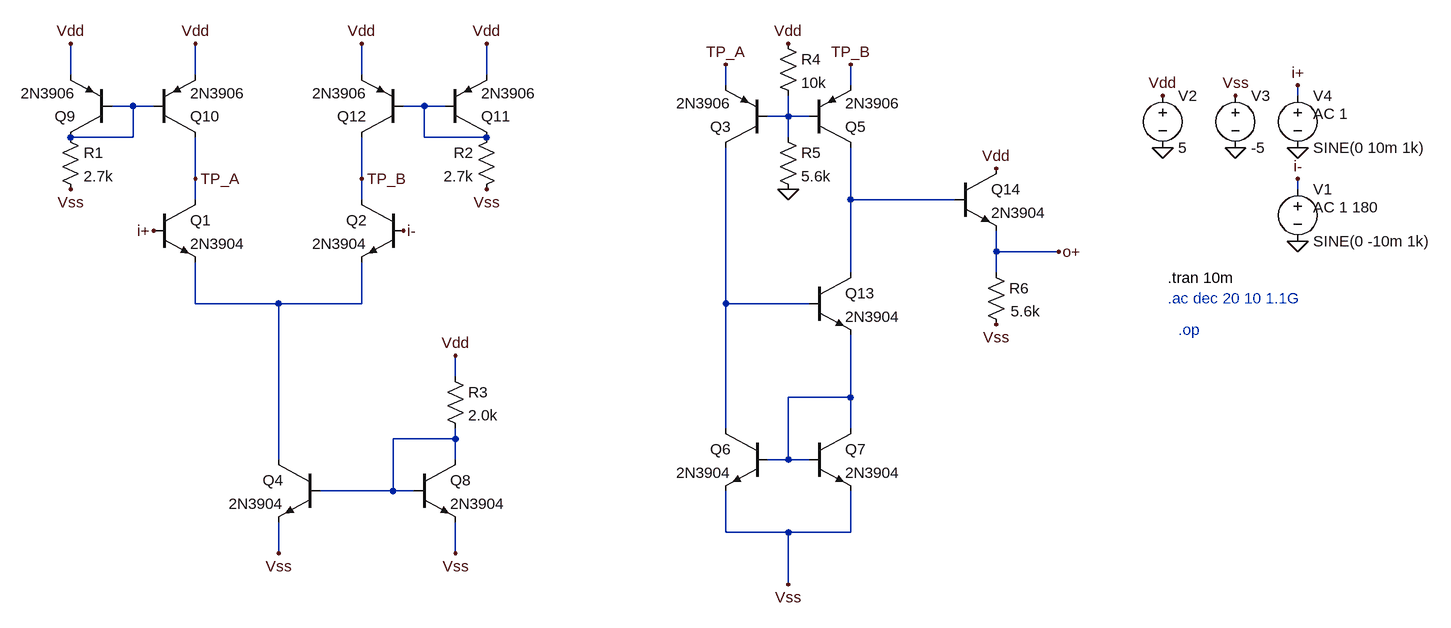
[diagram p0: schematic task1 - Copy.asc]
task1 - Copy.asc, the LTspice schematic file:
Version 4
SHEET 1 1288 680
WIRE -992 -688 -992 -736
WIRE -800 -688 -800 -736
WIRE -544 -688 -544 -736
WIRE -352 -688 -352 -736
WIRE 16 -672 16 -704
WIRE 208 -672 208 -704
WIRE 896 -656 896 -672
WIRE -896 -640 -928 -640
WIRE -864 -640 -896 -640
WIRE -448 -640 -480 -640
WIRE -416 -640 -448 -640
WIRE 112 -624 112 -656
WIRE 112 -624 80 -624
WIRE 144 -624 112 -624
WIRE -896 -592 -896 -640
WIRE -896 -592 -992 -592
WIRE -448 -592 -448 -640
WIRE -352 -592 -448 -592
WIRE 112 -592 112 -624
WIRE -800 -528 -800 -592
WIRE -544 -528 -544 -592
WIRE 896 -512 896 -528
WIRE -800 -496 -800 -528
WIRE -544 -496 -544 -528
WIRE 208 -496 208 -576
WIRE 368 -496 208 -496
WIRE 432 -416 432 -448
WIRE 528 -416 432 -416
WIRE 208 -384 208 -496
WIRE 432 -384 432 -416
WIRE -800 -336 -800 -400
WIRE -672 -336 -800 -336
WIRE -544 -336 -544 -400
WIRE -544 -336 -672 -336
WIRE 16 -336 16 -576
WIRE 144 -336 16 -336
WIRE -400 -224 -400 -256
WIRE 208 -192 208 -288
WIRE 208 -192 112 -192
WIRE 16 -144 16 -336
WIRE 208 -144 208 -192
WIRE -400 -128 -400 -144
WIRE -400 -128 -496 -128
WIRE -672 -96 -672 -336
WIRE -400 -96 -400 -128
WIRE 112 -96 112 -192
WIRE 112 -96 80 -96
WIRE 144 -96 112 -96
WIRE -496 -48 -496 -128
WIRE -496 -48 -608 -48
WIRE -464 -48 -496 -48
WIRE 16 16 16 -48
WIRE 112 16 16 16
WIRE 208 16 208 -48
WIRE 208 16 112 16
WIRE -672 48 -672 0
WIRE -400 48 -400 0
WIRE 112 96 112 16
FLAG 896 -432 0
FLAG 688 -576 0
FLAG 896 -528 i-
FLAG 688 -656 Vdd
FLAG 800 -576 0
FLAG 800 -656 Vss
FLAG 896 -576 0
FLAG 896 -672 i+
FLAG -672 48 Vss
FLAG -480 -448 i-
FLAG -864 -448 i+
FLAG 528 -416 o+
FLAG -400 48 Vss
FLAG -400 -256 Vdd
FLAG -992 -736 Vdd
FLAG -992 -512 Vss
FLAG -800 -736 Vdd
FLAG -352 -736 Vdd
FLAG -352 -512 Vss
FLAG -544 -736 Vdd
FLAG -800 -528 TP_A
FLAG -544 -528 TP_B
FLAG 208 -704 TP_B
FLAG 16 -704 TP_A
FLAG 112 96 Vss
FLAG 112 -512 0
FLAG 112 -736 Vdd
FLAG 432 -544 Vdd
FLAG 432 -304 Vss
SYMBOL voltage 896 -528 R0
WINDOW 123 24 44 Left 2
WINDOW 39 0 0 Left 0
SYMATTR Value2 AC 1 180
SYMATTR InstName V1
SYMATTR Value SINE(0 -10m 1k)
SYMBOL voltage 688 -672 R0
WINDOW 123 0 0 Left 0
WINDOW 39 0 0 Left 0
SYMATTR InstName V2
SYMATTR Value 5
SYMBOL npn -864 -496 R0
SYMATTR InstName Q1
SYMATTR Value 2N3904
SYMBOL voltage 800 -672 R0
WINDOW 123 0 0 Left 0
WINDOW 39 0 0 Left 0
SYMATTR InstName V3
SYMATTR Value -5
SYMBOL voltage 896 -672 R0
WINDOW 123 24 44 Left 2
WINDOW 39 0 0 Left 0
SYMATTR Value2 AC 1
SYMATTR InstName V4
SYMATTR Value SINE(0 10m 1k)
SYMBOL npn -480 -496 M0
SYMATTR InstName Q2
SYMATTR Value 2N3904
SYMBOL npn -608 -96 M0
SYMATTR InstName Q4
SYMATTR Value 2N3904
SYMBOL pnp 80 -576 R180
SYMATTR InstName Q3
SYMATTR Value 2N3906
SYMBOL pnp 144 -576 M180
SYMATTR InstName Q5
SYMATTR Value 2N3906
SYMBOL npn 80 -144 M0
SYMATTR InstName Q6
SYMATTR Value 2N3904
SYMBOL npn 144 -144 R0
SYMATTR InstName Q7
SYMATTR Value 2N3904
SYMBOL npn -464 -96 R0
SYMATTR InstName Q8
SYMATTR Value 2N3904
SYMBOL res -416 -240 R0
SYMATTR InstName R3
SYMATTR Value 2.0k
SYMBOL pnp -928 -592 R180
SYMATTR InstName Q9
SYMATTR Value 2N3906
SYMBOL pnp -864 -592 M180
SYMATTR InstName Q10
SYMATTR Value 2N3906
SYMBOL res -1008 -608 R0
SYMATTR InstName R1
SYMATTR Value 2.7k
SYMBOL pnp -416 -592 M180
SYMATTR InstName Q11
SYMATTR Value 2N3906
SYMBOL pnp -480 -592 R180
SYMATTR InstName Q12
SYMATTR Value 2N3906
SYMBOL res -336 -608 M0
SYMATTR InstName R2
SYMATTR Value 2.7k
SYMBOL npn 144 -384 R0
SYMATTR InstName Q13
SYMATTR Value 2N3904
SYMBOL res 96 -752 R0
SYMATTR InstName R4
SYMATTR Value 10k
SYMBOL res 96 -608 R0
SYMATTR InstName R5
SYMATTR Value 5.6k
SYMBOL npn 368 -544 R0
SYMATTR InstName Q14
SYMATTR Value 2N3904
SYMBOL res 416 -400 R0
WINDOW 3 38 76 Left 2
SYMATTR InstName R6
SYMATTR Value 5.6k
TEXT 696 -376 Left 2 !.tran 10m
TEXT 696 -344 Left 2 ;.ac dec 20 10 1.1G
TEXT 712 -296 Left 2 ;.op

The netlist it stands for:
* task1 - Copy.asc
V1 i- 0 SINE(0 -10m 1k) AC 1 180
V2 Vdd 0 5
Q1 TP_A i+ N005 0 2N3904
V3 Vss 0 -5
V4 i+ 0 SINE(0 10m 1k) AC 1
Q2 TP_B i- N005 0 2N3904
Q4 N005 N008 Vss 0 2N3904
Q3 N006 N003 TP_A 0 2N3906
Q5 N004 N003 TP_B 0 2N3906
Q6 N006 N007 Vss 0 2N3904
Q7 N007 N007 Vss 0 2N3904
Q8 N008 N008 Vss 0 2N3904
R3 Vdd N008 2.0k
Q9 N001 N001 Vdd 0 2N3906
Q10 TP_A N001 Vdd 0 2N3906
R1 N001 Vss 2.7k
Q11 N002 N002 Vdd 0 2N3906
Q12 TP_B N002 Vdd 0 2N3906
R2 N002 Vss 2.7k
Q13 N004 N006 N007 0 2N3904
R4 Vdd N003 10k
R5 N003 0 5.6k
Q14 Vdd N004 o+ 0 2N3904
R6 o+ Vss 5.6k
.model NPN NPN
.model PNP PNP
.lib standard.bjt
.tran 10m
* .ac dec 20 10 1.1G
* .op
.backanno
.end